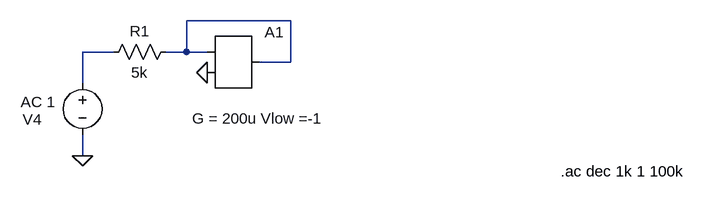
[diagram p0: schematic EJE4.asc]
EJE4.asc, the LTspice schematic file:
Version 4
SHEET 1 880 680
WIRE -688 -352 -848 -352
WIRE -960 -304 -1008 -304
WIRE -848 -304 -848 -352
WIRE -848 -304 -880 -304
WIRE -816 -304 -848 -304
WIRE -688 -288 -688 -352
WIRE -688 -288 -736 -288
WIRE -1008 -256 -1008 -304
WIRE -1008 -144 -1008 -176
FLAG -1008 -144 0
FLAG -816 -272 0
SYMBOL voltage -1008 -272 R0
WINDOW 123 -95 45 Left 2
WINDOW 39 0 0 Left 0
WINDOW 0 -92 72 Left 2
SYMATTR Value2 AC 1
SYMATTR InstName V4
SYMATTR Value ""
SYMBOL res -864 -320 R90
WINDOW 0 0 56 VBottom 2
WINDOW 3 32 56 VTop 2
SYMATTR InstName R1
SYMATTR Value 5k
SYMBOL SpecialFunctions\\ota -784 -352 R0
WINDOW 3 -55 151 Left 2
SYMATTR InstName A1
SYMATTR Value G = 200u Vlow =-1
TEXT -272 -120 Left 2 !.ac dec 1k 1 100k

The netlist it stands for:
* EJE4.asc
V4 N002 0 AC 1
R1 N001 N002 5k
A1 N001 0 0 0 0 0 N001 0 OTA G = 200u Vlow =-1
.ac dec 1k 1 100k
.backanno
.end